# Altium schematic sheet CM3_CON.SchDoc: =DocumentName
size A4; Author: Leihonglun; CompanyName: SoundWedge; DocumentNumber: 1; SheetNumber: 1; SheetTotal: 4; SheetTitle: CM3_CON.SchDoc
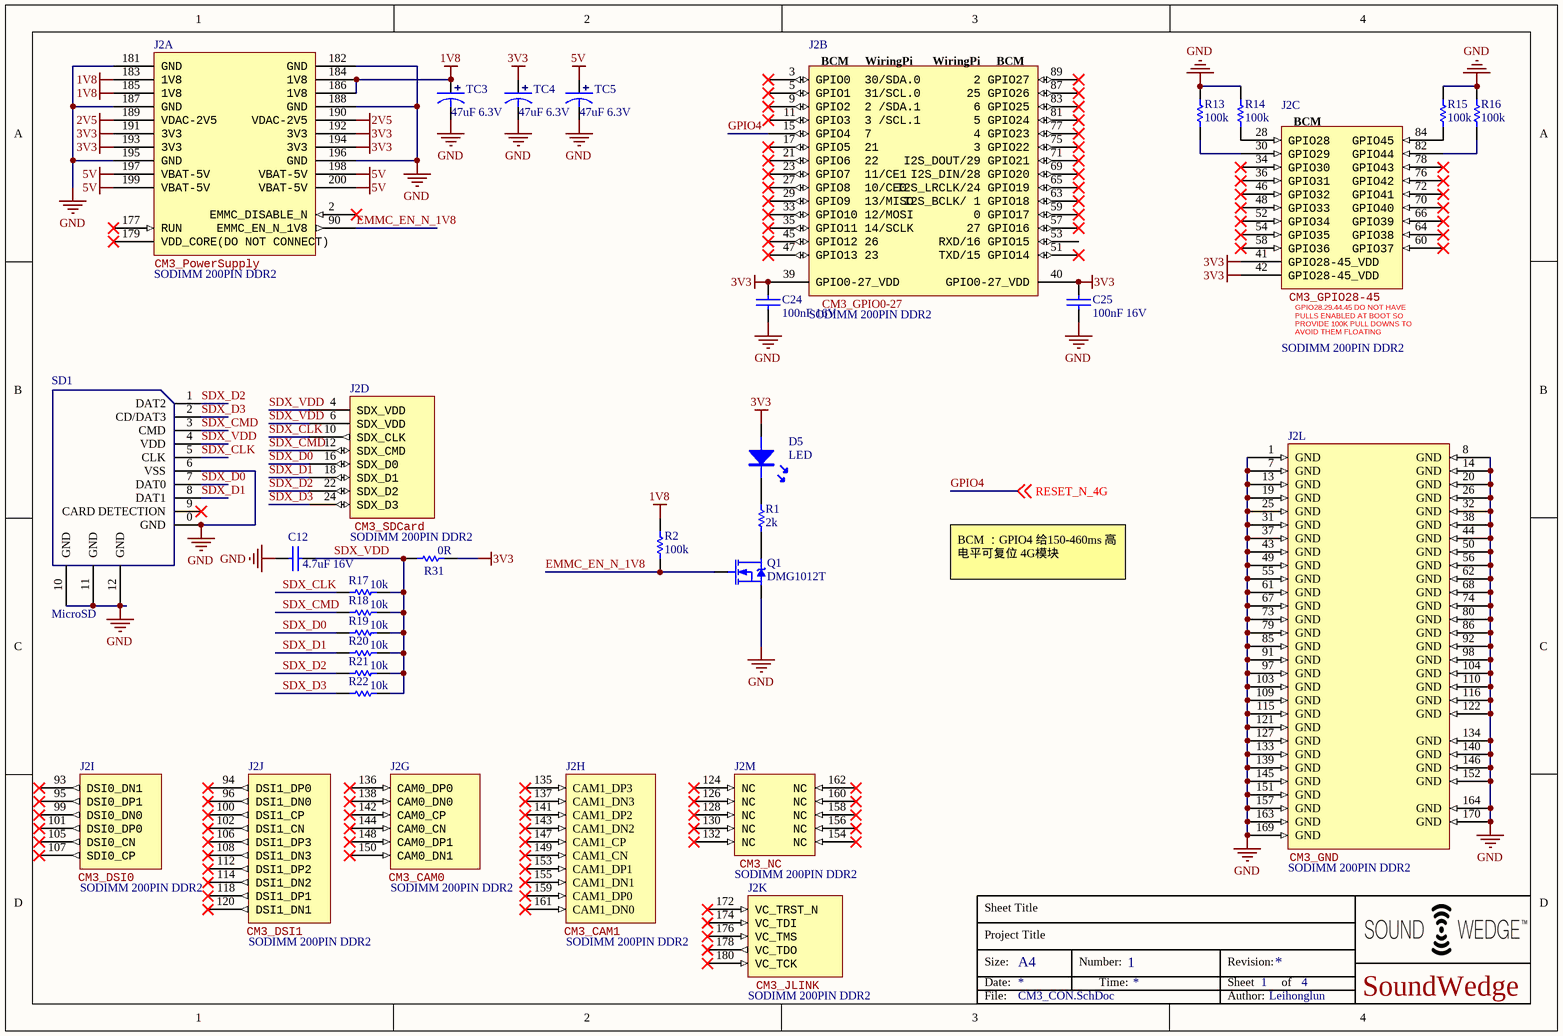
[diagram p0: CM3_CON.SchDoc]

## Parts
C12  4.7uF 16V  [0402C]
C24  100nF 16V  [0402C]
C25  100nF 16V  [0402C]
D5  LED  [LED-0603G]
J2  SODIMM 200PIN DDR2  [SODIMM 200PIN - 5.2H]  (parts A,B,C,D,G,H,I,J,K,L,M of 13)
Q1  DMG1012T  [SOT523]
R1  2k  [0402R]
R2  100k  [0402R]
R13  100k  [0402R]
R14  100k  [0402R]
R15  100k  [0402R]
R16  100k  [0402R]
R17  10k  [0402R]
R18  10k  [0402R]
R19  10k  [0402R]
R20  10k  [0402R]
R21  10k  [0402R]
R22  10k  [0402R]
R31  0R  [0402R]
SD1  MicroSD  [Micro SD]
TC3  47uF 6.3V  [TAJ-A/3216]
TC4  47uF 6.3V  [TAJ-A/3216]
TC5  47uF 6.3V  [TAJ-A/3216]

## Nets
1V8: J2.183(1V8) J2.184(1V8) J2.185(1V8) J2.186(1V8) R2.2 TC3.1
2V5: J2.189(VDAC-2V5) J2.190(VDAC-2V5)
3V3: C24.2 C25.2 D5.A J2.39(GPIO0-27_VDD) J2.40(GPIO0-27_VDD) J2.41(GPIO28-45_VDD) J2.42(GPIO28-45_VDD) J2.191(3V3) J2.192(3V3) J2.193(3V3) J2.194(3V3) R31.2 TC4.1
5V: J2.197(VBAT-5V) J2.198(VBAT-5V) J2.199(VBAT-5V) J2.200(VBAT-5V) TC5.1
GND: C12.1 C24.1 C25.1 J2.1(GND) J2.7(GND) J2.8(GND) J2.13(GND) J2.14(GND) J2.19(GND) J2.20(GND) J2.25(GND) J2.26(GND) J2.31(GND) J2.32(GND) J2.37(GND) J2.38(GND) J2.43(GND) J2.44(GND) J2.49(GND) J2.50(GND) J2.55(GND) J2.56(GND) J2.61(GND) J2.62(GND) J2.67(GND) J2.68(GND) J2.73(GND) J2.74(GND) J2.79(GND) J2.80(GND) J2.85(GND) J2.86(GND) J2.91(GND) J2.92(GND) J2.97(GND) J2.98(GND) J2.103(GND) J2.104(GND) J2.109(GND) J2.110(GND) J2.115(GND) J2.116(GND) J2.121(GND) J2.122(GND) J2.127(GND) J2.133(GND) J2.134(GND) J2.139(GND) J2.140(GND) J2.145(GND) J2.146(GND) J2.151(GND) J2.152(GND) J2.157(GND) J2.163(GND) J2.164(GND) J2.169(GND) J2.170(GND) J2.181(GND) J2.182(GND) J2.187(GND) J2.188(GND) J2.195(GND) J2.196(GND) Q1.S R13.2 R14.2 R15.2 R16.2 SD1.0(GND) SD1.6(VSS) SD1.10(GND) SD1.11(GND) SD1.12(GND) TC3.2 TC4.2 TC5.2
EMMC_EN_N_1V8: J2.90(EMMC_EN_N_1V8) Q1.G R2.1
GPIO4: J2.15(GPIO4__7) ; off-sheet RESET_N_4G  [also labelled RESET_N_4G]
SDX_CLK: J2.10(SDX_CLK) R17.1 SD1.5(CLK)
SDX_CMD: J2.12(SDX_CMD) R18.1 SD1.3(CMD)
SDX_D0: J2.16(SDX_D0) R19.1 SD1.7(DAT0)
SDX_D1: J2.18(SDX_D1) R20.1 SD1.8(DAT1)
SDX_D2: J2.22(SDX_D2) R21.1 SD1.1(DAT2)
SDX_D3: J2.24(SDX_D3) R22.1 SD1.2(CD/DAT3)
SDX_VDD: C12.2 J2.4(SDX_VDD) J2.6(SDX_VDD) R17.2 R18.2 R19.2 R20.2 R21.2 R22.2 R31.1 SD1.4(VDD)
NetD5_K: D5.K R1.1
NetJ2_28: J2.28(GPIO28) R14.1
NetJ2_30: J2.30(GPIO29) R13.1
NetJ2_82: J2.82(GPIO44) R16.1
NetJ2_84: J2.84(GPIO45) R15.1
NetQ1_D: Q1.D R1.2

Not connected (* = marked no-connect by the designer): J2 2(EMMC_DISABLE_N)* 3(GPIO0__30/SDA.0)* 5(GPIO1__31/SCL.0)* 9(GPIO2__2_/SDA.1)* 11(GPIO3__3_/SCL.1)* 17(GPIO5__21)* 21(GPIO6__22)* 23(GPIO7__11/CE1)* 27(GPIO8__10/CE0)* 29(GPIO9__13/MISO)* 33(GPIO10_12/MOSI)* 34(GPIO30)* 35(GPIO11_14/SCLK)* 36(GPIO31)* 45(GPIO12_26)* 46(GPIO32)* 47(GPIO13_23)* 48(GPIO33)* 51(TXD/15_GPIO14)* 52(GPIO34)* 53(RXD/16_GPIO15) 54(GPIO35)* 57(27_GPIO16)* 58(GPIO36)* 59(0_GPIO17)* 60(GPIO37)* 63(I2S_BCLK/_1_GPIO18)* 64(GPIO38)* 65(I2S_LRCLK/24_GPIO19)* 66(GPIO39)* 69(I2S_DIN/28_GPIO20)* 70(GPIO40)* 71(I2S_DOUT/29_GPIO21)* 72(GPIO41)* 75(3_GPIO22)* 76(GPIO42)* 77(4_GPIO23)* 78(GPIO43)* 81(5_GPIO24)* 83(6_GPIO25)* 87(25_GPIO26)* 89(2_GPIO27)* 93(DSI0_DN1)* 94(DSI1_DP0)* 95(DSI0_DP1)* 96(DSI1_DN0)* 99(DSI0_DN0)* 100(DSI1_CP)* 101(DSI0_DP0)* 102(DSI1_CN)* 105(DSI0_CN)* 106(DSI1_DP3)* 107(SDI0_CP)* 108(DSI1_DN3)* 112(DSI1_DP2)* 114(DSI1_DN2)* 118(DSI1_DP1)* 120(DSI1_DN1)* 124(NC)* 126(NC)* 128(NC)* 130(NC)* 132(NC)* 135(CAM1_DP3)* 136(CAM0_DP0)* 137(CAM1_DN3)* 138(CAM0_DN0)* 141(CAM1_DP2)* 142(CAM0_CP)* 143(CAM1_DN2)* 144(CAM0_CN)* 147(CAM1_CP)* 148(CAM0_DP1)* 149(CAM1_CN)* 150(CAM0_DN1)* 153(CAM1_DP1)* 154(NC)* 155(CAM1_DN1)* 156(NC)* 158(NC)* 159(CAM1_DP0)* 160(NC)* 161(CAM1_DN0)* 162(NC)* 172(VC_TRST_N)* 174(VC_TDI)* 176(VC_TMS)* 177(RUN)* 178(VC_TDO)* 179(VDD_CORE(DO_NOT_CONNECT))* 180(VC_TCK)*; SD1 9(CARD_DETECTION)*

## Notes on the sheet
- BCM ：GPIO4 给150-460ms 高电平可复位 4G模块
- Sheet Title
- Project Title
- Size:
- Date:
- A4
- Number:
- Time:
- Revision:
- Sheet
- of
- File:
- Author:
- (in symbol RPi-CM3, part A) CM3_PowerSupply
- (in symbol RPi-CM3, part B) BCM; WiringPi; CM3_GPIO0-27
- (in symbol RPi-CM3, part C) BCM; CM3_GPIO28-45; GPIO28.29.44.45 DO NOT HAVE PULLS ENABLED AT BOOT SO PROVIDE 100K PULL DOWNS TO AVOID THEM FLOATING
- (in symbol RPi-CM3, part D) CM3_SDCard
- (in symbol RPi-CM3, part G) CM3_CAM0
- (in symbol RPi-CM3, part H) CM3_CAM1
- (in symbol RPi-CM3, part I) CM3_DSI0
- (in symbol RPi-CM3, part J) CM3_DSI1
- (in symbol RPi-CM3, part K) CM3_JLINK
- (in symbol RPi-CM3, part L) CM3_GND
- (in symbol RPi-CM3, part M) CM3_NC

## Library data of the parts
C12 C24 C25 = CAP-NP
D5 = LED: 绿色
J2 = RPi-CM3
Q1 = N-MOS: N沟道场效应管
R1 R2 R13-R22 R31 = RES
SD1 = MicroSD: 佐田¦(自弹)TF卡座 micro sd卡座; ComponentLink1Description: taobao.com; ComponentLink1URL: https://detail.tmall.com/item.htm?id=44131369945&spm=a1z09.2.0.0.73b72e8dl9KedD&_u=am2gus40e9e
TC3-TC5 = TCAP